# Altium schematic sheet Sheet1.SchDoc
size A; SheetNumber: 1; SheetTotal: 1
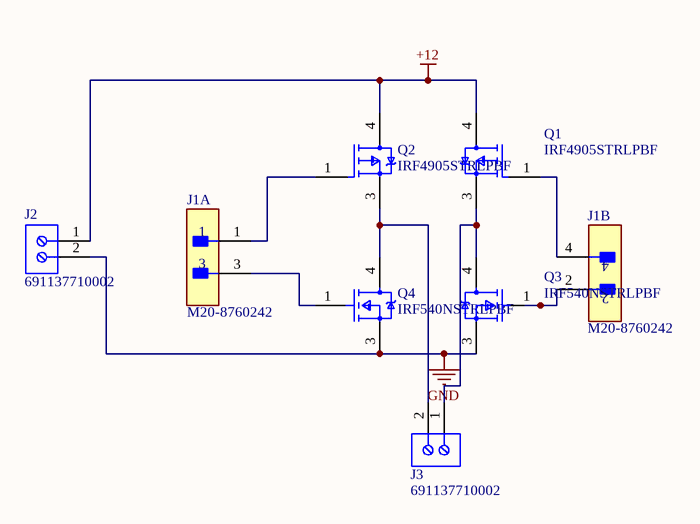
[diagram p0: Sheet1.SchDoc]

## Parts
J1  M20-8760242  [FP-M20-8760242-MFG]  (parts A,B of 2)
J2  691137710002  [691137710002]
J3  691137710002  [691137710002]
Q1  IRF4905STRLPBF  [FP-PG-TO263-3-MFG]
Q2  IRF4905STRLPBF  [FP-PG-TO263-3-MFG]
Q3  IRF540NSTRLPBF  [FP-PG-TO263-3-MFG]
Q4  IRF540NSTRLPBF  [FP-PG-TO263-3-MFG]

## Nets
+12: J2.1 Q1.4(D) Q2.4(D)
GND: J2.2 Q3.3(SOURCE) Q4.3(SOURCE)
NetJ1_1: J1.1 Q2.1(G)
NetJ1_2: J1.2 Q3.1(GATE)
NetJ1_3: J1.3 Q4.1(GATE)
NetJ1_4: J1.4 Q1.1(G)
NetJ3_1: J3.1 Q1.3(S) Q3.4(DRAIN)
NetJ3_2: J3.2 Q2.3(S) Q4.4(DRAIN)

## Library data of the parts
J1 = CMP-15831-000048-1: CONN HEADER SMD 4POS 2.54MM; Contact Resistance: 25mR; Max Current Rating: 3A; Row Spacing: 0.1inch; Gender: Male; Number of Contacts: 4; Connector Type: Male Pin; Contact Mating Length: 0.228inch; Max Operating Temperature: 105°C; Depth: 5.08mm; Contact Material: Bronze; Packaging: Bulk; Series: M20; Radiation Hardening: No; Length: 5.08mm; Contact Type: Male Pin; Housing Material: Nylon; Pitch: 2.54mm; Color: Black; RoHS Compliant: Yes; Package Quantity: 1000; Orientation: Straight; Housing Color: Black; Min Operating Temperature: -40°C; Termination: Solder; Contact Plating: Gold; Mount: Surface Mount; Number of Rows: 2; Number of Positions: 4
J2 J3 = CMP-1502-03324-2: NexarPartId: 78871135; Voltage Rating: 300V; Number of Contacts: 2; Current Rating: 16A; Lead Pitch: 5mm; Height: 11.6mm; Packaging: Box; RoHS: Non-Compliant; Contact Material: Nickel, Tin; Max Operating Temperature: 120°C; Number of Pins: 2; Min Operating Temperature: -30°C; Number of Rows: 1
Q1 Q2 = CMP-32901-000610-1: MOSFET P-CH 55V 42A D2PAK; Max Dual Supply Voltage: -55V; Max Power Dissipation: 170W; Rds On Max: 20mR; Input Capacitance: 3.5nF; Threshold Voltage: 4V; RoHS Compliant: Yes; Packaging: Tape and Reel; REACH SVHC: No SVHC; Continuous Drain Current (ID): 42A; Mount: Surface Mount; Drain to Source Voltage (Vdss): -55V; Max Operating Temperature: 150°C; Number of Pins: 3; Lead Free: Contains Lead; Case/Package: TO-263-3; Min Operating Temperature: -55°C; Halogen Free: Halogen Free
Q3 Q4 = CMP-00196-65873407-1: IRF540NSTRLPBF Transistor MOSFET N Channel 100 Volt 33 Amp 3-Pin 2+ Tab D2pak Tape And Reel; Drain to Source Voltage (Vdss): 100V; Rise Time: 35ns; Resistance: 44MΩ; Gate to Source Voltage (Vgs): 20V; Turn-Off Delay Time: 39ns; Recovery Time: 170ns; Number of Elements: 1; Max Junction Temperature (Tj): 175°C; Nominal Vgs: 4V; Element Configuration: Single; Current Rating: 33A; Power Dissipation: 3.8W; Turn-On Delay Time: 11ns; Input Capacitance: 1.96nF; Rds On Max: 8.4mΩ; Min Operating Temperature: -55°C; Lead Free: Lead Free; Packaging: Bulk; Voltage Rating (DC): 100V; Radiation Hardening: No; Height: 4.826mm; Schedule B: 8541290080, 8541290080; Mount: Surface Mount; Drain to Source Breakdown Voltage: 100V; Number of Pins: 3; Contact Plating: Tin; NexarPartId: 65873407; Max Operating Temperature: 175°C; Continuous Drain Current (ID): 33A; Termination: SMD/SMT; On-State Resistance: 44mΩ; Threshold Voltage: 4V; RoHS: Compliant; Dual Supply Voltage: 100V; Max Power Dissipation: 3.8W; Lifecycle Status: NRND; Width: 9.65mm; Drain to Source Resistance: 44mΩ; Fall Time: 35ns; Case/Package: D2PAK; Length: 10.668mm; Number of Channels: 1; Package Quantity: 800; REACH SVHC: No SVHC